# EAGLE design BodyCamBoard (EAGLE 6.6.0)
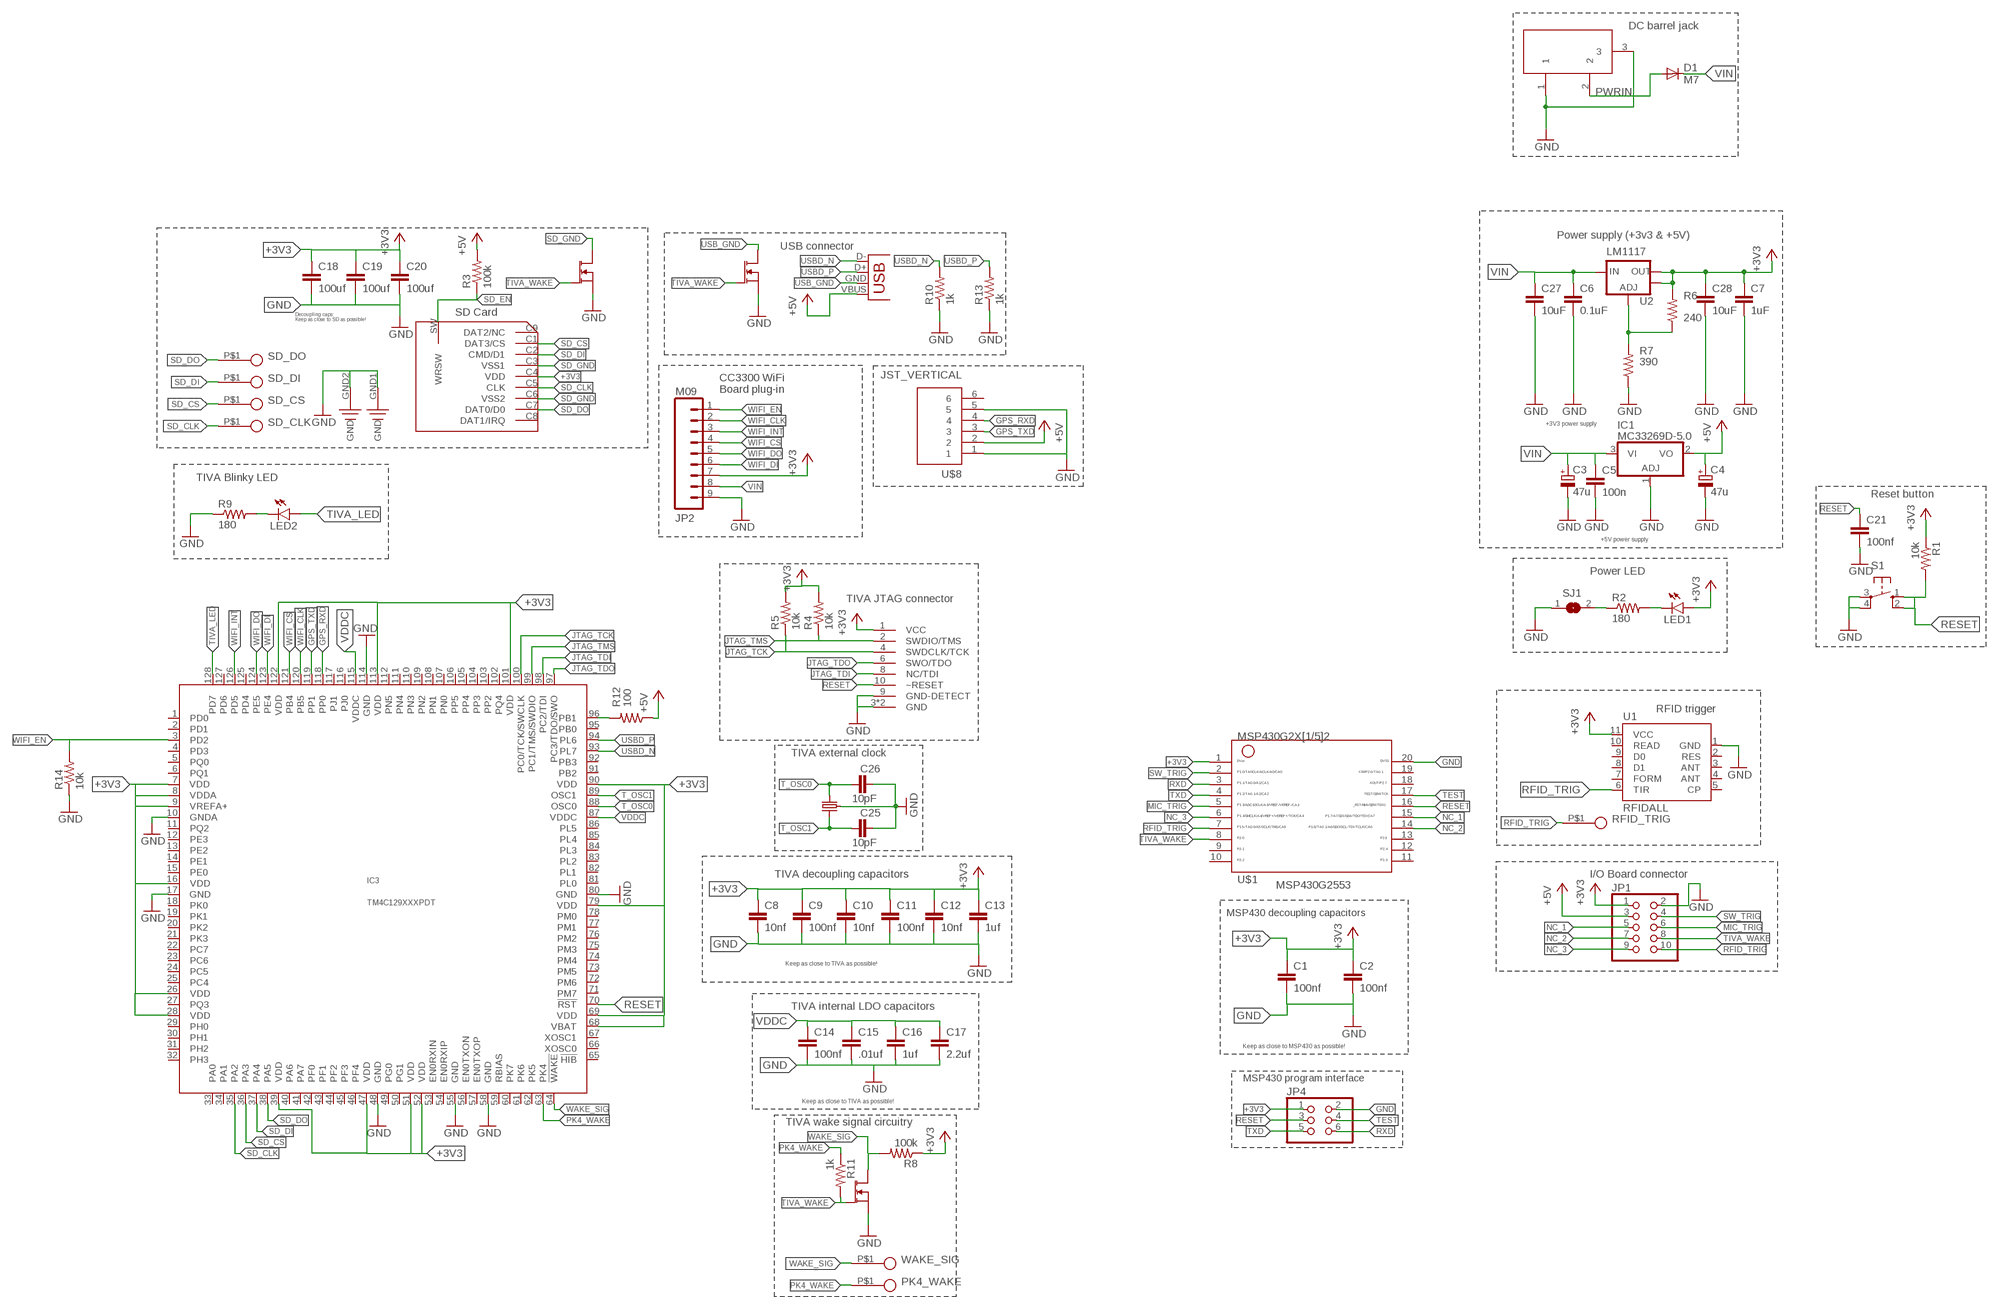
[diagram p0: schematic, sheet 1]

## Parts
C1  100nf  C-EUC0603  [C0603]
C2  100nf  C-EUC0603  [C0603]
C3  47u  CPOL-EUD  [PANASONIC_D]
C4  47u  CPOL-EUD  [PANASONIC_D]
C5  100n  C-EUC0603  [C0603]
C6  0.1uF  CAP0603-CAP  [0603-CAP]
C7  1uF  CAP0603-CAP  [0603-CAP]
C8  10nf  C-EUC0805  [C0805]
C9  100nf  C-EUC0805  [C0805]
C10  10nf  C-EUC0805  [C0805]
C11  100nf  C-EUC0805  [C0805]
C12  10nf  C-EUC0805  [C0805]
C13  1uf  C-EUC0805  [C0805]
C14  100nf  C-EUC0805  [C0805]
C15  .01uf  C-EUC0805  [C0805]
C16  1uf  C-EUC0805  [C0805]
C17  2.2uf  C-EUC0805  [C0805]
C18  100uf  C-EUC1206  [C1206]
C19  100uf  C-EUC1206  [C1206]
C20  100uf  C-EUC1206  [C1206]
C21  100nf  C-EUC0603  [C0603]
C25  10pF  C-EUC0603  [C0603]
C26  10pF  C-EUC0603  [C0603]
C27  10uF  CAP0603-CAP  [0603-CAP]
C28  10uF  CAP0603-CAP  [0603-CAP]
D1  M7  DIODE-SMB  [SMB]
IC1  MC33269D-5.0  [DPACK]
IC3  TM4C129XXXPDT  [PDT_S-PQFP-G128]
JP1  PINHD-2X5  [2X05]
JP2  M09  [1X09]
JP4  PINHD-2X3  [2X03]
LED1  LED0603  [LED-0603@1]
LED2  LED0603  [LED-0603@1]
PK4_WAKE  TEST_POINTSMD_MINI  [TEST_SMD_MINI_5019]
R1  10k  R-US_R0603  [R0603]
R2  180  R-US_R0603  [R0603]
R3  100k  R-US_R0603  [R0603]
R4  10k  R-US_R0603  [R0603]
R5  10k  R-US_R0603  [R0603]
R6  240  RESISTOR0603  [0603-RES]
R7  390  RESISTOR0603  [0603-RES]
R8  100k  R-US_R0603  [R0603]
R9  180  R-US_R0603  [R0603]
R10  1k  R-US_R0402  [R0402]
R11  1k  R-US_R0603  [R0603]
R12  100  RESISTOR0603  [0603-RES]
R13  1k  R-US_R0402  [R0402]
R14  10k  R-US_R0603  [R0603]
RFID_TRIG  TEST_POINTSMD_MINI  [TEST_SMD_MINI_5019]
S1  10-XX  [B3F-10XX]
SD_CLK  TEST_POINTSMD_MINI  [TEST_SMD_MINI_5019]
SD_CS  TEST_POINTSMD_MINI  [TEST_SMD_MINI_5019]
SD_DI  TEST_POINTSMD_MINI  [TEST_SMD_MINI_5019]
SD_DO  TEST_POINTSMD_MINI  [TEST_SMD_MINI_5019]
SJ1  SJ  [SJ]
U1  RFIDALL  [ID_PACKAGE]
U2  LM1117  V_REG_LM1117SOT223  [SOT223]
U$1  G2X[1/5]2---PW20  [PW20]
U$2  CCM05  [CCM05]
U$3  CRYSTAL_403C11E16  [4-SMD-SWITCH]
U$4  IRLML2402TRPBF  [SOT-23]
U$5  IRLML2402TRPBF  [SOT-23]
U$6  IRLML2402TRPBF  [SOT-23]
U$7  2X5_0.05"_CORTEX_DEBUGTH_KEYED_UNSHROUDED  [2X5_0.05"_TH_KEYED_NS]
U$8  JST_VERTICAL  [JST-6-SMD-VERT-1.0MM]
WAKE_SIG  TEST_POINTSMD_MINI  [TEST_SMD_MINI_5019]
X1  USB-A-H  [USB-A-H]
X2  DC21MMX  [DC-21MM]

## Nets
+3V3: C1.1 C2.1 C7.1 C8.1 C9.1 C10.1 C11.1 C12.1 C13.1 C18.1 C19.1 C20.1 C28.1 IC3.7(VDD) IC3.8(VDDA) IC3.9(VREFA+) IC3.16(VDD) IC3.26(VDD) IC3.28(VDD) IC3.39(VDD) IC3.47(VDD) IC3.51(VDD) IC3.52(VDD) IC3.68(VBAT) IC3.69(VDD) IC3.79(VDD) IC3.90(VDD) IC3.101(VDD) IC3.113(VDD) IC3.122(VDD) JP1.1 JP2.7 JP4.1 LED1.A R1.1 R4.2 R5.2 R6.2 R8.1 U1.11(VCC) U2.2(OUT) U2.4(OUT) U$1.1 U$2.C4(SDCARD:VDD) U$7.1(VCC)
+5V: C4.+ IC1.2(VO) JP1.3 R3.2 R12.1 U$8.2 X1.VBUS(GND)
GND: C1.2 C2.2 C3.- C4.- C5.2 C6.2 C7.2 C8.2 C9.2 C10.2 C11.2 C12.2 C13.2 C14.2 C15.2 C16.2 C17.2 C18.2 C19.2 C20.2 C21.2 C25.2 C26.2 C27.2 C28.2 IC1.1(ADJ) IC3.10(GNDA) IC3.17(GND) IC3.48(GND) IC3.55(GND) IC3.58(GND) IC3.80(GND) IC3.114(GND) JP1.2 JP2.9 JP4.2 R7.1 R10.1 R13.1 R14.1 S1.3(P) S1.4(P1) SJ1.1 U1.1(GND) U$1.20 U$2.GND1(GND1:GND) U$2.GND2(GND2:GND) U$3.2(GND) U$3.4(GND) U$4.2(S) U$5.2(S) U$6.2(S) U$7.3(GND) U$7.5(GND) U$7.9(GND-DETECT) U$8.1 U$8.5 X2.1 X2.3
GPS_RXD: IC3.118(PP0) U$8.4
GPS_TXD: IC3.119(PP1) U$8.3
JTAG_TCK: IC3.100(PC0/TCK/SWCLK) R5.1 U$7.4(SWDCLK/TCK)
JTAG_TDI: IC3.98(PC2/TDI) U$7.8(NC/TDI)
JTAG_TDO: IC3.97(PC3/TDO/SWO) U$7.6(SWO/TDO)
JTAG_TMS: IC3.99(PC1/TMS/SWDIO) R4.1 U$7.2(SWDIO/TMS)
MIC_TRIG: JP1.6 U$1.5
N$1: LED1.C R2.2
N$2: R2.1 SJ1.2
N$3: R9.1
N$4: LED2.C R9.2
N$11: R6.1 R7.2 U2.1(ADJ)
N$56: IC3.96(PB1) R12.2
NC_1: JP1.5 U$1.15
NC_2: JP1.7 U$1.14
NC_3: JP1.9 U$1.6
PK4_WAKE: IC3.63(PK4) PK4_WAKE.P$1 R11.1
PWRIN: D1.A X2.2
RESET: C21.1 IC3.70(!RST) JP4.3 R1.2 S1.1(S) S1.2(S1) U$1.16 U$7.10(~RESET)
RFID_TRIG: JP1.10 RFID_TRIG.P$1 U1.6(TIR) U$1.7
RXD: JP4.6 U$1.3
SD_CLK: IC3.35(PA2) SD_CLK.P$1 U$2.C5(SDCARD:CLK)
SD_CS: IC3.36(PA3) SD_CS.P$1 U$2.C1(SDCARD:DAT3/CS)
SD_DI: IC3.37(PA4) SD_DI.P$1 U$2.C2(SDCARD:CMD/D1)
SD_DO: IC3.38(PA5) SD_DO.P$1 U$2.C7(SDCARD:DAT0/D0)
SD_EN: R3.1 U$2.SW(SDCARD:WRSW)
SD_GND: U$2.C3(SDCARD:VSS1) U$2.C6(SDCARD:VSS2) U$5.3(D)
SW_TRIG: JP1.4 U$1.2
T_OSC0: C26.1 IC3.88(OSC0) U$3.3
T_OSC1: C25.1 IC3.89(OSC1) U$3.1
TEST: JP4.4 U$1.17
TIVA_LED: IC3.128(PD7) LED2.A
TIVA_WAKE: JP1.8 R11.2 U$1.8 U$4.1(G) U$5.1(G) U$6.1(G)
TXD: JP4.5 U$1.4
USB_GND: U$4.3(D) X1.GND(VBUS)
USBD_N: IC3.93(PL7) R10.2 X1.D-(D+)
USBD_P: IC3.94(PL6) R13.2 X1.D+(D-)
VDDC: C14.1 C15.1 C16.1 C17.1 IC3.87(VDDC) IC3.115(VDDC)
VIN: C3.+ C5.1 C6.1 C27.1 D1.C IC1.3(VI) JP2.8 U2.3(IN)
WAKE_SIG: IC3.64(!WAKE) R8.2 U$6.3(D) WAKE_SIG.P$1
WIFI_CLK: IC3.120(PB5) JP2.2
WIFI_CS: IC3.121(PB4) JP2.4
WIFI_DI: IC3.123(PE4) JP2.6
WIFI_DO: IC3.124(PE5) JP2.5
WIFI_EN: IC3.3(PD2) JP2.1 R14.2
WIFI_INT: IC3.126(PD5) JP2.3
Unconnected: IC3.1(PD0) IC3.2(PD1) IC3.4(PD3) IC3.5(PQ0) IC3.6(PQ1) IC3.11(PQ2) IC3.12(PE3) IC3.13(PE2) IC3.14(PE1) IC3.15(PE0) IC3.18(PK0) IC3.19(PK1) IC3.20(PK2) IC3.21(PK3) IC3.22(PC7) IC3.23(PC6) IC3.24(PC5) IC3.25(PC4) IC3.27(PQ3) IC3.29(PH0) IC3.30(PH1) IC3.31(PH2) IC3.32(PH3) IC3.33(PA0) IC3.34(PA1) IC3.40(PA6) IC3.41(PA7) IC3.42(PF0) IC3.43(PF1) IC3.44(PF2) IC3.45(PF3) IC3.46(PF4) IC3.49(PG0) IC3.50(PG1) IC3.53(EN0RXIN) IC3.54(EN0RXIP) IC3.56(EN0TXON) IC3.57(EN0TXOP) IC3.59(RBIAS) IC3.60(PK7) IC3.61(PK6) IC3.62(PK5) IC3.65(!HIB) IC3.66(XOSC0) IC3.67(XOSC1) IC3.71(PM7) IC3.72(PM6) IC3.73(PM5) IC3.74(PM4) IC3.75(PM3) IC3.76(PM2) IC3.77(PM1) IC3.78(PM0) IC3.81(PL0) IC3.82(PL1) IC3.83(PL2) IC3.84(PL3) IC3.85(PL4) IC3.86(PL5) IC3.91(PB2) IC3.92(PB3) IC3.95(PB0) IC3.102(PQ4) IC3.103(PP2) IC3.104(PP3) IC3.105(PP4) IC3.106(PP5) IC3.107(PN0) IC3.108(PN1) IC3.109(PN2) IC3.110(PN3) IC3.111(PN4) IC3.112(PN5) IC3.116(PJ0) IC3.117(PJ1) IC3.125(PD4) IC3.127(PD6) U1.2(RES) U1.3(ANT) U1.4(ANT) U1.5(CP) U1.7(FORM) U1.8(D1) U1.9(D0) U1.10(READ) U$1.9 U$1.10 U$1.11 U$1.12 U$1.13 U$1.18 U$1.19 U$2.C8(SDCARD:DAT1/IRQ) U$2.C9(SDCARD:DAT2/NC) U$8.6

## Notes on the sheet
- DC barrel jack
- Power supply (+3v3 & +5V)
- USB connector
- SD Card
- Decoupling caps:
  Keep as close to SD as possible!
- CC3300 WiFi 
  Board plug-in
- +3V3 power supply
- TIVA Blinky LED
- Reset button
- +5V power supply
- Power LED
- TIVA JTAG connector
- RFID trigger
- TIVA external clock
- TIVA decoupling capacitors | I/O Board connector
- MSP430G2553
- MSP430 decoupling capacitors
- Keep as close to TIVA as possible!
- TIVA internal LDO capacitors
- Keep as close to MSP430 as possible!
- MSP430 program interface
- Keep as close to TIVA as possible!
- TIVA wake signal circuitry

## Library data of the parts
C1 C2 C5 C8-C21 = rcl:C-EU: CAPACITOR, European symbol
C3 C4 = rcl:CPOL-EU: POLARIZED CAPACITOR, European symbol
C6 C7 C27 C28 = SparkFun-Capacitors:CAP: Capacitor Standard 0603 ceramic capacitor, and 0.1" leaded capacitor.
C25 C26 = Jon_LIB:C-EU: CAPACITOR, European symbol; DIGIKEY#: 399-1049-1-ND
D1 = diode:DIODE-: DIODE
IC1 = linear:MC33269?*: Adjustable Output Low Dropout Voltage Regulator 800 mA Source: http://www.onsemi.com/pub/Collateral/MC33269-D.PDF
IC3 = ti-tiva:TM4C129XXX
JP1 = pinhead:PINHD-2X5: PIN HEADER
JP2 = SparkFun-Connectors:M09: Header 9 Standard 9-pin 0.1" header. Use with straight break away headers (SKU : PRT-00116), right angle break away headers (PRT-00553), swiss pins (PRT-00743), machine pins (PRT-00117), and female headers (PRT-00115).
JP4 = pinhead:PINHD-2X3: PIN HEADER
LED1 LED2 = SparkFun-LED:LED: LEDs Standard schematic elements and footprints for 5mm, 3mm, 1206, and 0603 sized LEDs. 5mm - Spark Fun Electronics SKU : COM-00529 (and others)
PK4_WAKE RFID_TRIG SD_CLK SD_CS SD_DI SD_DO WAKE_SIG = MAAV_Standard:TEST_POINT
R1-R5 R8 R9 R11 R14 = resistor:R-US_: RESISTOR, American symbol
R6 R7 R12 = SparkFun-Resistors:RESISTOR: Resistor Basic schematic elements and footprints for 0603, 1206, and PTH resistors.
R10 R13 = rcl:R-US_: RESISTOR, American symbol
S1 = switch-omron:10-XX: OMRON SWITCH; MPN: B3F-1000; OC_FARNELL: 176432; OC_NEWARK: 36M3542
SJ1 = jumper:SJ: SMD solder JUMPER
U1 = ID_Innovations:RFID
U2 = SparkFun-PowerIC:V_REG_LM1117: Voltage Regulator LM1117 Standard adjustable voltage regulator but in SMD form. Spark Fun Electronics SKU : COM-00595
U$1 = TI_MSP430_v16:G2X[1/5]2---PW20: MSP430G2X[1/5]2 MSP430G2x52, MSP430G2x12 TSSOP (PW) 20 Pin Package http://focus.ti.com/docs/prod/folders/print/msp430g2452.html
U$2 = sd:CCM05
U$3 = imu:CRYSTAL_403C11E16; DIGIKEY: 403C11E16M00000
U$4-U$6 = MOSFET:IRLML2402TRPBF
U$7 = con-cortex:2X5_0.05"_CORTEX_DEBUG
U$8 = SparkFun-Connectors:JST_VERTICAL; PROD_ID: CONN-08249
X1 = SparkFun:USB: USB Connectors USB-B-PTH is fully proven SKU : PRT-00139 USB-miniB is fully proven SKU : PRT-00587 USB-A-PCB is untested. USB-A-H is throughly reviewed, but untested. Spark Fun Electronics SKU : PRT-00437 USB-B-SMT is throughly reviewed, but untested. Needs silkscreen touching up. USB-A-S has not been used/tested USB-MB-H has not been used/tested
X2 = powersupply:DC21MM

## Board
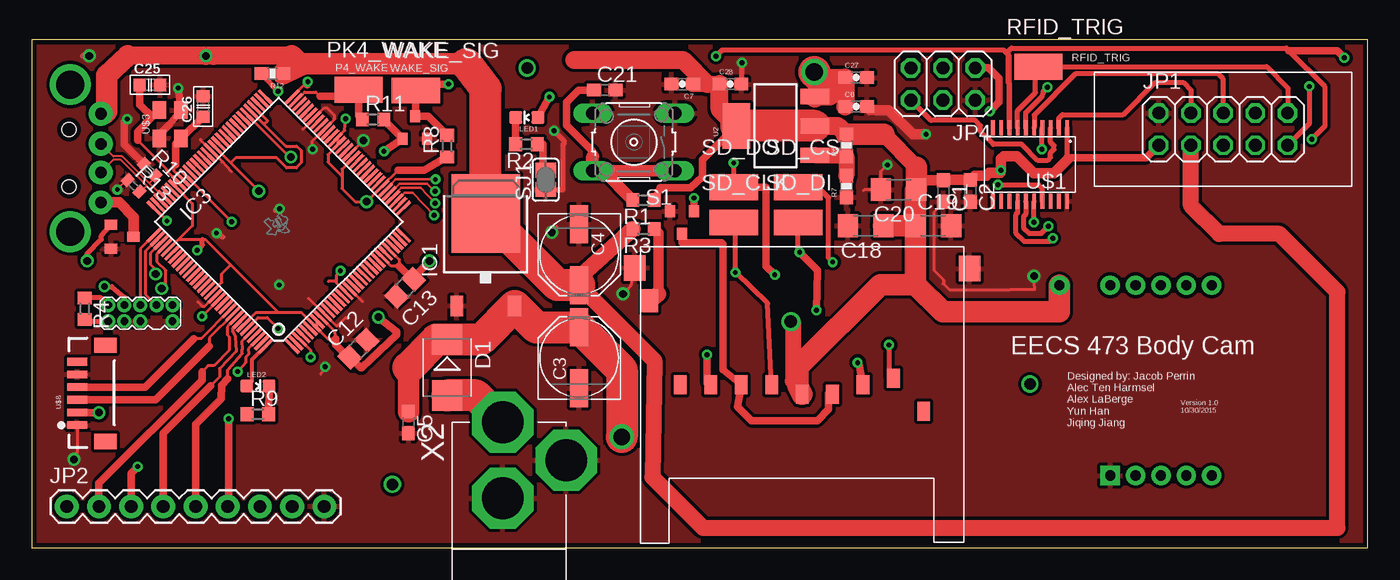
[diagram p1: board, top side]
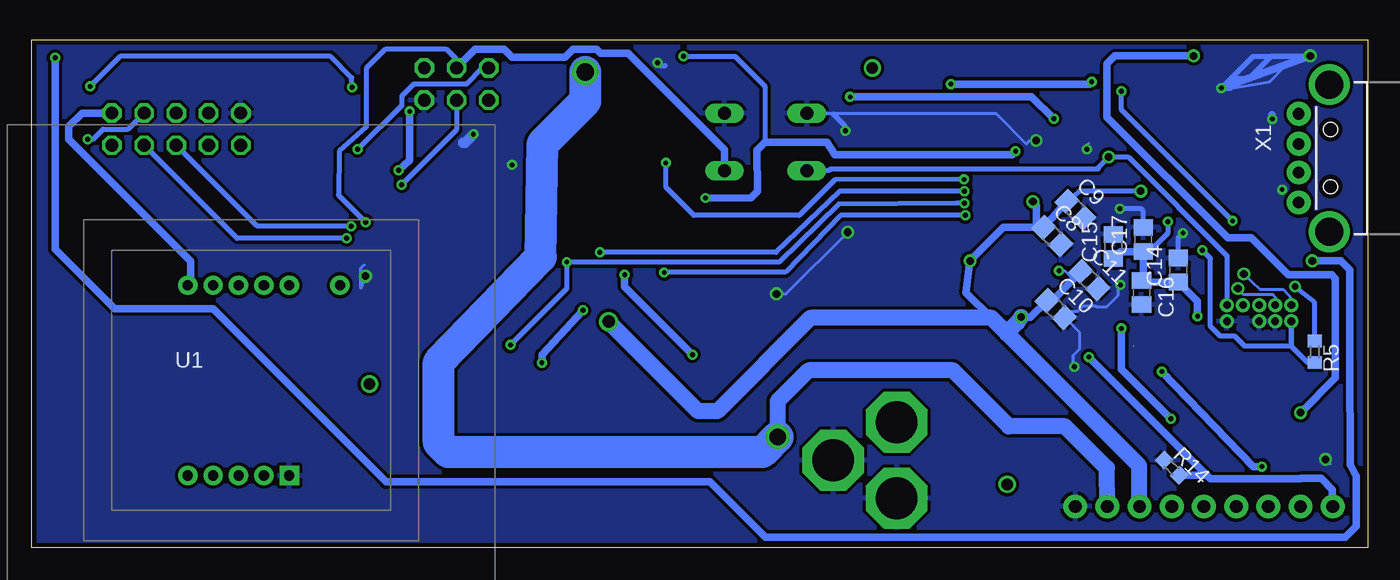
[diagram p2: board, bottom side, seen from below]

Size 105.39 x 40.06 mm. Coordinates in mm from the lower left corner, seen from the top.
Outline: 0,0 105.39,0 105.39,40.06 0,40.06 0,0
Copper layers (1*16): Top 0.035559375mm / dielectric 1.501140625mm / Bottom 0.035559375mm
Design rules "typical_4pcb *": minimum track width 6mil, minimum drill 15mil, track to track 5mil, track to pad 5mil, pad to pad 5mil, via to via 5mil, smd to smd 5mil, copper to edge 15mil, drill to drill 8mil, minimum pad ring 10mil, minimum via ring 8mil, stop-mask expansion 4mil, vias tented up to drill 0mil, thermal gap 10mil

### Footprints (pad centres in the part's own frame; a part is rotated, then mirrored left to right if it is on the bottom)
C0603 = smd 1.1 x 1: 1 -0.85,0; 2 0.85,0
PANASONIC_D = smd 3 x 1.4: + 2.4,0; - -2.4,0
0603-CAP = smd 1.1 x 1: 1 -0.85,0; 2 0.85,0
C0805 = smd 1.3 x 1.5: 1 -0.95,0; 2 0.95,0
C1206 = smd 1.6 x 1.8: 1 -1.4,0; 2 1.4,0
C0603' = smd 0.95 x 1: 1 -0.8,0; 2 0.8,0
SMB = smd 2.4 x 2.4: A 2.2,0; C -2.2,0
DPACK = smd 1 x 1.6: 1 -2.28,-4.8; 3 2.28,-4.8 | smd 5.4 x 6.2: 2 0,2.5
PDT_S-PQFP-G128 = smd 0.25 x 1.6: 1 -6.2,-7.65; 2 -5.8,-7.65; 3 -5.4,-7.65; 4 -5,-7.65; 5 -4.6,-7.65; 6 -4.2,-7.65; 7 -3.8,-7.65; 8 -3.4,-7.65; 9 -3,-7.65; 10 -2.6,-7.65; 11 -2.2,-7.65; 12 -1.8,-7.65; 13 -1.4,-7.65; 14 -1,-7.65; 15 -0.6,-7.65; 16 -0.2,-7.65; 17 0.2,-7.65; 18 0.6,-7.65; 19 1,-7.65; 20 1.4,-7.65; 21 1.8,-7.65; 22 2.2,-7.65; 23 2.6,-7.65; 24 3,-7.65; 25 3.4,-7.65; 26 3.8,-7.65; 27 4.2,-7.65; 28 4.6,-7.65; 29 5,-7.65; 30 5.4,-7.65; 31 5.8,-7.65; 32 6.2,-7.65; 65 6.2,7.65; 66 5.8,7.65; 67 5.4,7.65; 68 5,7.65; 69 4.6,7.65; 70 4.2,7.65; 71 3.8,7.65; 72 3.4,7.65; 73 3,7.65; 74 2.6,7.65; 75 2.2,7.65; 76 1.8,7.65; 77 1.4,7.65; 78 1,7.65; 79 0.6,7.65; 80 0.2,7.65; 81 -0.2,7.65; 82 -0.6,7.65; 83 -1,7.65; 84 -1.4,7.65; 85 -1.8,7.65; 86 -2.2,7.65; 87 -2.6,7.65; 88 -3,7.65; 89 -3.4,7.65; 90 -3.8,7.65; 91 -4.2,7.65; 92 -4.6,7.65; 93 -5,7.65; 94 -5.4,7.65; 95 -5.8,7.65; 96 -6.2,7.65 | smd 1.6 x 0.25: 33 7.65,-6.2; 34 7.65,-5.8; 35 7.65,-5.4; 36 7.65,-5; 37 7.65,-4.6; 38 7.65,-4.2; 39 7.65,-3.8; 40 7.65,-3.4; 41 7.65,-3; 42 7.65,-2.6; 43 7.65,-2.2; 44 7.65,-1.8; 45 7.65,-1.4; 46 7.65,-1; 47 7.65,-0.6; 48 7.65,-0.2; 49 7.65,0.2; 50 7.65,0.6; 51 7.65,1; 52 7.65,1.4; 53 7.65,1.8; 54 7.65,2.2; 55 7.65,2.6; 56 7.65,3; 57 7.65,3.4; 58 7.65,3.8; 59 7.65,4.2; 60 7.65,4.6; 61 7.65,5; 62 7.65,5.4; 63 7.65,5.8; 64 7.65,6.2; 97 -7.65,6.2; 98 -7.65,5.8; 99 -7.65,5.4; 100 -7.65,5; 101 -7.65,4.6; 102 -7.65,4.2; 103 -7.65,3.8; 104 -7.65,3.4; 105 -7.65,3; 106 -7.65,2.6; 107 -7.65,2.2; 108 -7.65,1.8; 109 -7.65,1.4; 110 -7.65,1; 111 -7.65,0.6; 112 -7.65,0.2; 113 -7.65,-0.2; 114 -7.65,-0.6; 115 -7.65,-1; 116 -7.65,-1.4; 117 -7.65,-1.8; 118 -7.65,-2.2; 119 -7.65,-2.6; 120 -7.65,-3; 121 -7.65,-3.4; 122 -7.65,-3.8; 123 -7.65,-4.2; 124 -7.65,-4.6; 125 -7.65,-5; 126 -7.65,-5.4; 127 -7.65,-5.8; 128 -7.65,-6.2
2X05 = drill 1.016 octagon: 1 -5.08,-1.27; 2 -5.08,1.27; 3 -2.54,-1.27; 4 -2.54,1.27; 5 0,-1.27; 6 0,1.27; 7 2.54,-1.27; 8 2.54,1.27; 9 5.08,-1.27; 10 5.08,1.27
1X09 = drill 1.016 pad 1.88: 1 0,0; 2 2.54,0; 3 5.08,0; 4 7.62,0; 5 10.16,0; 6 12.7,0; 7 15.24,0; 8 17.78,0; 9 20.32,0
2X03 = drill 1.016 octagon: 1 -2.54,-1.27; 2 -2.54,1.27; 3 0,-1.27; 4 0,1.27; 5 2.54,-1.27; 6 2.54,1.27
LED-0603@1 = smd 1 x 1: A 0,-0.877; C 0,0.877
TEST_SMD_MINI_5019 = smd 3.81 x 2.032: P$1 0,0
R0603 = smd 1 x 1.1: 1 -0.85,0; 2 0.85,0
0603-RES = smd 1.1 x 1: 1 -0.85,0; 2 0.85,0
R0402 = smd 0.7 x 0.9: 1 -0.65,0; 2 0.65,0
B3F-10XX = drill 1.016 long: 1 -3.251,2.261; 2 3.251,2.261; 3 -3.251,-2.261; 4 3.251,-2.261
SJ = smd 1.168 x 1.6: 1 -0.762,0; 2 0.762,0
ID_PACKAGE = drill 0.8 pad 1.524 square: 1 3,-7.5 | drill 0.8 pad 1.524: 2 1,-7.5; 3 -1,-7.5; 4 -3,-7.5; 5 -5,-7.5; 6 -5,7.5; 7 -3,7.5; 8 -1,7.5; 9 1,7.5; 10 3,7.5; 11 7,7.5
SOT223 = smd 1.219 x 2.235: 1 -2.311,-3.099; 2 0,-3.099; 3 2.311,-3.099 | smd 3.6 x 2.2: 4 0,3.099
PW20 = smd 0.3 x 1.2: 1 -2.925,-2.9; 2 -2.275,-2.9; 3 -1.625,-2.9; 4 -0.975,-2.9; 5 -0.325,-2.9; 6 0.325,-2.9; 7 0.975,-2.9; 8 1.625,-2.9; 9 2.275,-2.9; 10 2.925,-2.9; 11 2.925,2.9; 12 2.275,2.9; 13 1.625,2.9; 14 0.975,2.9; 15 0.325,2.9; 16 -0.325,2.9; 17 -0.975,2.9; 18 -1.625,2.9; 19 -2.275,2.9; 20 -2.925,2.9
CCM05 = smd 1.5 x 1: C1 1.25,-7.2; C2 0.75,-4.8; C3 0,-2.4; C4 0,0; C5 0.75,2.4; C6 0.75,4.8; C7 0.75,7.2; C8 0.75,9.6; C9 -1.35,-9.6 | smd 2 x 1.7: GND1 9.95,13.2; GND2 9.9,-13.2 | smd 1.8 x 1.3: SW 7.35,12
4-SMD-SWITCH = smd 1.372 x 1.067: 1 -1.118,-0.864; 2 1.118,-0.864; 3 1.118,0.864; 4 -1.118,0.864
SOT-23 = smd 0.965 x 0.787: 1 -0.886,0.953; 2 -0.886,-0.953; 3 0.886,0
2X5_0.05"_TH_KEYED_NS = drill 0.6 pad 0.95: 1 -2.54,-0.635; 2 -2.54,0.635; 3 -1.27,-0.635; 4 -1.27,0.635; 5 0,-0.635; 6 0,0.635; 8 1.27,0.635; 9 2.54,-0.635; 10 2.54,0.635
JST-6-SMD-VERT-1.0MM = smd 0.6 x 1.55: 1 -2.54,1.27; 2 -1.54,1.27; 3 -0.54,1.27; 4 0.46,1.27; 5 1.46,1.27; 6 2.46,1.27 | smd 1.2 x 1.8: P$1 -3.84,-0.955; P$2 3.76,-0.955
USB-A-H = drill 0.914 pad 1.88: D+ 2.4,1.127; D- 2.4,-1.127; GND 2.4,3.5; VBUS 2.4,-3.5 | drill 2.2: GND@1 0,5.8; GND@2 0,-5.8 | hole 1.1: -0.1,2.25; -0.1,-2.25
DC-21MM = drill 3.302 pad 4.826 octagon: 1 -5.08,-3.353; 2 -0.076,-6.35; 3 -0.076,-0.356

### Placement (x,y rotation side)
C1  71.91,28.13 270 top
C2  74.04,28.16 270 top
C3  43.18,14.99 90 top
C4  43.18,23.11 270 top
C5  29.72,9.91 270 top
C6  65.02,34.8 0 top
C7  51.31,36.58 180 top
C8  24.9,24.59 315 bottom
C9  23.06,26.66 315 bottom
C10  24.62,18.84 315 bottom
C11  21.95,21.13 315 bottom
C12  25.76,15.7 45 top
C13  29.44,20.5 225 top
C14  14.95,21.91 90 bottom
C15  20.07,23.78 90 bottom
C16  17.84,20.13 270 bottom
C17  17.72,24.32 90 bottom
C18  65.79,25.4 180 top
C19  71.12,25.4 0 top
C20  68.39,28.26 180 top
C21  45.21,36.1 0 top
C25  10pF  [C0603']  9.33,36.51 0 top
C26  10pF  [C0603']  13.53,34.8 90 top
C27  65.02,37.08 0 top
C28  55.12,36.58 0 top
D1  32.77,14.22 270 top
IC1  35.81,23.88 0 top
IC3  19.48,25.73 45 top
JP1  93.98,33.02 0 top
JP2  2.76,3.27 0 top
JP4  71.88,36.58 180 top
LED1  39.05,33.94 90 top
LED2  17.84,12.76 270 top
PK4_WAKE  25.78,36.13 0 top
R1  48.26,27.43 180 top
R2  39.02,31.85 180 top
R3  48.26,25.15 180 top
R4  4.19,18.86 270 top
R5  4.19,15.46 270 bottom
R6  64.26,31.75 90 top
R7  64.26,28.51 90 top
R8  32.77,31.69 90 top
R9  17.84,10.54 0 top
R10  9.3,29.82 315 top
R11  26.92,33.78 0 top
R12  18.99,37.4 180 top
R13  8.03,28.55 315 top
R14  15.47,6.33 315 bottom
RFID_TRIG  79.41,37.94 0 top
S1  47.5,32 180 top
SD_CLK  55.37,25.65 0 top
SD_CS  60.45,28.45 0 top
SD_DI  60.45,25.65 0 top
SD_DO  55.37,28.45 0 top
SJ1  40.54,29.02 90 top
U1  88.07,13.21 0 bottom
U2  58.67,33.27 90 top
U$1  78.74,30.23 180 top
U$2  60.77,12.13 90 top
U$3  10.92,33.4 270 top
U$4  7.14,24.54 0 top
U$5  51.31,25.65 270 top
U$6  30.23,33.15 90 top
U$7  8.57,18.51 0 top
U$8  4.86,12.22 90 top
WAKE_SIG  30.29,36.07 0 top
X1  3.05,30.73 180 bottom
X2  37.08,3.56 180 top

### Tracks (layer width: path | path; a pad name or v marks a point on that pad's centre or on a via)
+3V3  (via drill 0.38, 0.6, 1)
  Top 0.254: 23.87,32.13 IC3.52 24.19,32.41 | IC3.47 24.48,29.88 24.48,29.3 | 24.19,32.41 24.7,32.93 v24.77,33.85 | 28.89,29.78 27.58,28.47 | 27.58,28.47 IC3.39 | IC3.113 14.99,20.95 14.99,21.62 15.64,22.27 15.73,22.27 | IC3.9 23.86,17.11 23.96,16.58 | 23.96,16.58 23.97,16.51 | IC3.28 28.99,22.73 28.99,22.23 28.35,22.23 27.61,22.97 IC3.26 | 22.49,17.36 IC3.7 21.26,18.57 19.43,18.57 | 22.49,17.36 23.34,16.51 23.89,16.51 23.96,16.58 | IC3.122 16.77,17.63 17.72,18.57 19.43,18.57 | IC3.101 10.84,23.57 11.59,24.32 | 11.59,24.32 13.46,24.32 13.68,24.32 15.73,22.27 | 15.73,22.27 19.43,18.57 | 27.58,28.47 v26.42,27.3 25.5,27.3 24.48,28.32 24.48,29.3 | IC3.79 15.7,30.36 | 15.7,30.36 17.91,28.15 v17.91,28.13 | IC3.68 18.57,33.72 18.57,33.66 18.35,33.43 18.29,33.43 IC3.69 20.03,31.69 20.89,31.69 21.24,31.34 21.24,30.35 20.86,29.97 20.1,29.97 19.3,30.77 16.1,30.77 15.7,30.36 | IC3.90 11.39,28.43 12.67,27.15 12.67,25.4 11.59,24.32 | 24.07,20.86 23.92,21.01 23.39,21.01 | IC3.16 24.07,20.86 | 24.07,20.86 24.07,21.56 v24.35,21.84 | IC3.8 22.49,17.36 | 24.19,32.41 IC3.51 23.37,31.02 23.37,30.42 24.48,29.3
  Top 0.406: U$1.1 81.66,30.77 81.66,30.57 | R4.2 4.33,17.88 U$7.1 | v13.05,23.46 13.46,23.88 13.46,24.32
  Top 0.61: v40.83,35.56 40.82,35.55 LED1.A | R8.1 30.95,29.78 28.89,29.78 | R1.1 49.56,28.38 51.98,28.42 52.9,29.27 52.9,30.59 U2.4 | 81.66,30.77 87.92,30.77 JP1.1 | JP4.1 75.47,37.85 76.3,37.02 76.3,35.15 v75.56,34.42 | 23.97,16.51 23.97,16.03 24.57,15.44 C12.1 25.93,14.19 26.04,14.19 28.8,16.8 28.8,17.05 28.77,17.05 v27.34,18.19 | v31.37,22.64 30.12,21.32 C13.1 30.04,21.18 28.99,22.23
  Top 0.813: 81.66,30.57 80.64,29.56 79.06,29.56 77.72,30.9 76.68,30.9 76.45,30.68 v76.45,29.78 76.42,29.59 75.53,29.59 75.3,29.35 74.38,29.35 C2.1 71.94,29.01 C1.1 70.51,28.98 C20.1
  Top 1.27: 67.22,32.6 69.79,30.04 | C28.1 53.28,36.58 C7.1 | v59.88,17.84 60.04,17.84 60.04,13.18 60.45,12.76
  Top 1.422: U2.2 63.59,33.27 R6.2 | U2.4 54.27,34.58 C28.1 | 42.8,38.48 51.37,38.48 53.28,36.58
  Top 1.676: 69.72,20.77 71.88,18.61 81.08,18.61 U1.11 | 69.72,20.77 C19.1 | C19.1 69.72,28.19 C20.1 69.79,30.04 | C19.1 C18.1 | 69.72,20.77 66.93,20.77 60.45,14.29 60.45,12.76 U$2.C4 | R6.2 67.22,32.6
  Top 2.54: U2.2 U2.4
  Bottom 0.254: v24.35,21.84 23.91,21.84 23.23,21.17 | 23.29,21.1
  Bottom 0.406: R5.2 4.74,14.61 6.03,15.91 U$7.1 6.03,15.94 6,15.91 9.72,15.91 10.51,16.7 11.65,16.7 12.41,17.46 12.41,22.83 v13.05,23.46 | v17.91,28.13 22.72,28.13 C9.1
  Bottom 0.61: v24.77,33.85 26.54,35.56 v40.83,35.56 | v75.56,34.42 75.56,30.57 v76.45,29.78 | 29.69,18.13 31.69,20.13 v31.37,22.64 28.74,25.27 26.13,25.27 | v27.34,18.19 26.61,18.19 C10.1 24.89,19.51 23.29,21.1 23.23,21.17 C11.1 | 26.13,25.27 C8.1 C9.1 | v26.42,27.3 26.13,27.02 26.13,25.27
  Bottom 1.27: JP2.7 18.03,6.48 28.48,16.92 | 28.48,16.92 29.69,18.13 43.97,18.13 51.31,10.79 52.83,10.79 v59.88,17.84 | v27.34,18.19 27.62,17.78 28.48,16.92
+5V  (via drill 0.6)
  Top 0.61: U$8.2 3.6,10.67 v5.3,10.67
  Top 1.27: 43.02,21.17 43.18,20.92 C4.+ | R3.2 43.02,21.17 | 43.02,21.17 43.4,20.48 49.12,14.76 48.96,5.59 52.96,1.59 103,1.59 103,20.19 98.42,24.77 93.66,24.77 91.44,26.99 JP1.3
  Top 1.422: 20.51,38.8 14.32,38.8 v13.75,38.8 7.56,38.8
  Top 1.676: 34.29,38.16 21.49,38.16 R12.1 20.85,38.46 20.51,38.8 | 7.56,38.8 5.91,37.27 5.91,34.42 5.72,34.23 X1.VBUS
  Top 2.54: C4.+ 41.48,20.71 IC1.2 35.81,36.2 34.29,38.16
  Bottom 0.61: v5.3,10.67 2.57,13.4 2.57,21.24 2.86,21.53 6.25,21.53 9.18,24.45 11.05,24.45 20.57,33.97 20.57,38.16 19.93,38.8 v13.75,38.8
GND  (via drill 0.38, 0.6)
  Top 0.152: R13.1 7.45,29.01 v6.76,28.26
  Top 0.254: IC3.10 24.01,17.53 24.13,17.53 24.77,18.16 24.99,18.16 | IC3.10 23.62,17.91 | IC3.10 21.88,19.65 21.84,19.65 | IC3.80 13.34,32.16 13.3,32.19 14.99,30.51 | 14.99,30.51 15.02,30.42 | 14.99,30.51 15.75,29.69 | 21.4,33.02 IC3.58 23.08,34.7 23.27,34.7 23.84,34.13 23.84,33.77 IC3.55 23.04,32.94 23.01,32.94 22.1,32.04 v22.16,31.43 | IC3.48 v26.16,32.13 | U$8.1 3.59,7.62 v3.33,6.99 | U$2.GND1 47.25,20.64 v46.64,20.03 | v41.02,24.89 41.02,24.92 41.43,25.34 | 65.63,28.19 65.69,28.26 C20.2 66.99,29.68 v67.5,30.19 | C1.2 71.91,27.21 71.18,26.48 71.18,21.88 71.91,21.14 71.91,20.83 72.39,20.35 77.15,20.35 77.18,20.38 79.12,20.38 v79.06,21.43 | IC3.17 26.07,19.43 | IC3.114 13.62,19.02 13.49,19.02 13.11,19.4 | v23.15,14.29 23.15,14.06 22.8,13.72 | v19.53,20.73 19.56,20.73
  Top 0.406: 56.01,38.23 56.01,36.62 C28.2 56.04,36.65 v56.04,38.26 | v4.54,38.8 4,38.8 | v14.57,24.83 14.76,24.83 15.08,24.51 | v19.56,26.73 19.37,26.73 19.24,26.61 | SJ1.1 41.88,28.26 41.91,28.23 41.91,31.78 42.01,31.88 42.01,32.1 v41.21,32.89
  Top 0.61: U$3.2 10.06,32.57 10.86,33.37 U$3.4 v11.56,36.26 | R10.1 8.84,30.3 7.3,31.84 7.3,33.59 v7.53,33.81
  Top 0.813: C6.2 66.16,34.51 67.6,34.51 69.5,32.61 v70.55,32.61
  Bottom 0.152: v6.76,28.26 6.89,28.42 6.92,28.38
  Bottom 0.254: 10.79,36.26 7.75,36.77 6.54,37.97 | v11.56,36.26 10.99,36.83 10.16,36.83 | v26.16,32.13 26.64,32.13 26.92,31.84 29.3,34.23 42.2,34.23 44.23,34.23 | 3.37,7.02 v3.33,6.99 2.98,6.64 | v46.64,20.03 45.88,20.03 v41.02,24.89 | v79.06,21.43 79.44,20.48 79.44,22.04 79.15,22.32 | v67.5,30.19 67.5,30.39 67.47,30.42 | C10.2 23.88,18.17 | 23.88,18.17 23.24,17.53 23.24,17.49 22.77,17.02 22.77,15.65 23.27,15.14 23.27,14.41 v23.15,14.29 | 23.88,18.17 23.88,18.41 23.62,18.67 22.86,18.67 22.45,19.08 21.5,19.08 21.43,19.02 20.57,19.02 19.68,19.91 19.68,20.57 v19.53,20.73 | v22.16,31.43 22.04,31.88
  Bottom 0.406: v56.04,38.26 55.82,38.04 55.4,38.04 | 10.79,36.26 v11.56,36.26 10.76,37.05 | 10.76,37.05 9.05,38.77 4.76,38.77 | 10.76,37.05 9.34,37.05 7.59,38.8 v4.54,38.8 | C14.2 14.95,24.45 v14.57,24.83 | C17.2 17.72,26.57 17.88,26.73 v19.56,26.73 | v41.21,32.89 41.21,33.24 42.2,34.23
  Bottom 0.61: v11.56,36.26 v4.54,38.8 | v7.53,33.81 7.53,34.13 7.56,34.16
  Bottom 0.813: v70.55,32.61 71.22,31.94 71.37,31.94
  pour Bottom (isolate 0.254): -4.06,104.65 -4.06,-4.83 164.34,-4.83 164.34,104.65
  pour Top (isolate 0.254): -7.87,-8.13 10.16,-8.38 169.16,-8.38 169.16,109.98 -7.62,109.98 -7.62,4.83
GPS_RXD
  Top 0.254: IC3.118 13.38,16.51 12.79,16.51
  Top 0.61: 12.79,16.51 8.97,12.68 U$8.4
GPS_TXD
  Top 0.254: IC3.119 14,16.57 14,15.91
  Top 0.61: 14,15.91 9.78,11.68 U$8.3
JTAG_TCK  (via drill 0.5, 0.6)
  Top 0.254: IC3.100 9.87,23.19 9.87,22.57 10.57,21.88 10.57,20.77 v10.26,20.45
  Top 0.406: v5.75,20.61 6.32,20.61 7.3,19.78 U$7.4
  Bottom 0.254: U$7.4 7.3,19.78 7.49,19.97 9.81,19.97 10.26,20.41 v10.26,20.45
  Bottom 0.406: R5.1 4.19,19.37 v5.75,20.61
JTAG_TDI
  Top 0.254: IC3.98 8.95,23.4 8.95,20 9.81,19.14 U$7.8
JTAG_TDO
  Top 0.254: IC3.97 8.57,23.59 U$7.6
JTAG_TMS  (via drill 0.6)
  Top 0.254: IC3.99 9.37,23.25 9.37,22.35 9.78,21.94 v9.78,21.59
  Top 0.406: U$7.2 5.47,19.71 R4.1
  Bottom 0.254: v9.78,21.59 8.51,20.38 6.67,20.38 6.03,19.68 U$7.2
MIC_TRIG
  Top 0.406: JP1.6 93.98,36.99 93.6,37.37 82.33,37.37 79.09,34.13 79.09,33.15 U$1.5
N$1
  Top 0.61: LED1.C R2.2
N$2
  Top 0.61: R2.1 40.35,31.82 40.35,29.97 SJ1.2
N$4
  Top 0.61: LED2.C R9.2
N$5  (via drill 0.9)
  other vias: 28.45,5.02
N$6  (via drill 0.9)
  other vias: 78.74,12.92
N$7  (via drill 0.9)
  other vias: 39.08,37.85
N$11
  Top 1.27: R7.2 R6.1 64.2,30.96 U2.1
N$56  (via drill 0.38)
  Top 0.254: IC3.96 v10.67,25.78
  Top 0.406: v19.43,36.01 19.15,36.28 R12.2
  Bottom 0.406: v10.67,25.78 19.43,34.54 v19.43,36.01
NC_1  (via drill 0.38)
  Top 0.406: U$1.15 78.42,26.31 78.23,26.13 78.23,25.24 78.68,24.8 79.63,24.8 v80.2,25.37
  Bottom 0.406: v80.2,25.37 87.6,25.37 JP1.5
NC_2  (via drill 0.38)
  Top 0.406: U$1.14 77.77,26.43 77.6,26.26 77.6,24.86 78.3,24.16 80.3,24.16 v80.55,24.42
  Bottom 0.406: v80.55,24.42 89.19,24.42 JP1.7
NC_3  (via drill 0.38)
  Top 0.406: v100.78,36.39 100.78,33.47 JP1.9 | U$1.6 78.42,34.31 79.69,35.59 79.79,35.91 79.79,36.01 v80.11,36.32
  Bottom 0.406: v100.78,36.39 98.39,38.77 81.82,38.77 80.14,37.08 v80.11,36.32
PK4_WAKE
  Top 0.203: IC3.63 20.82,35.24 21.53,35.94
  Top 0.254: 21.53,35.94 22.42,35.94 22.73,35.62
  Top 0.61: R11.1 25.78,34.08 PK4_WAKE.P$1 25.27,35.62 22.73,35.62
PWRIN
  Top 2.54: X2.2 35.04,12.02 D1.A
RESET  (via drill 0.38, 0.6)
  Top 0.254: IC3.70 20.32,30.83
  Top 0.406: v79.06,25.69 79.06,27.32 U$1.16 | 20.32,30.83 v20.45,30.83
  Top 0.61: 44.25,30.88 44.25,31.29 42.2,33.34 42.2,35.15 43.15,36.1 C21.1
  Top 0.889: S1.1 S1.2 45.1,29.74 R1.2
  Top 1.016: S1.2 44.25,30.88
  Bottom 0.254: 21.27,29.88 20.35,30.8 20.35,30.83
  Bottom 0.406: JP4.3 71.88,38.51 72.68,39.31 77.5,39.31 78.99,37.81 78.99,33.18 81.12,31.27 81.19,27.81 v79.06,25.69 | S1.2 42.52,29.74 42.39,29.88 21.27,29.88 21.27,30 v20.45,30.83 | 20.35,30.83 18.89,30.83 11.11,23.05 U$7.10
  Bottom 0.61: S1.1 50.75,31.38 58.36,38.99 60.52,38.99 60.83,39.31 62.67,39.31 63.31,38.67 67.5,38.67 68.14,39.31 70.42,39.31 JP4.3
RFID_TRIG
  Top 0.406: U$1.7 77.77,34.49 79.18,35.91 79.18,37.72 RFID_TRIG.P$1 97.41,37.94 99.09,36.26 99.09,34.32 JP1.10
  Bottom 0.61: JP1.10 101.41,34.29 102.46,33.24 102.46,32.23 92.84,22.61 92.84,20.95 U1.6
RXD
  Top 0.406: JP4.6 70.93,33.72 74.42,33.72 74.83,33.31 74.83,32.83 75.85,31.81 78.11,31.81 79.38,30.54 80.11,30.54 80.36,30.8 80.36,31.15 80.64,31.43 80.64,31.72 80.36,32 U$1.3
SD_CLK  (via drill 0.38)
  Top 0.203: IC3.35 29.4,28 30.04,28 v31.75,26.23
  Top 0.406: SD_CLK.P$1 55.5,25.53 v55.5,21.72 58.05,19.29 U$2.C5
  Bottom 0.406: v31.75,26.23 41.59,26.23 45.94,21.75 55.47,21.75 v55.5,21.72 55.44,21.84
SD_CS  (via drill 0.38)
  Top 0.203: IC3.36 29.15,28.38 30.67,28.38 v31.81,27.18
  Top 0.406: v63.18,22.54 62.87,22.86 62.87,27.62 62.23,28.26 60.64,28.26 SD_CS.P$1 | v67.63,16 67.63,13.47 U$2.C1
  Bottom 0.406: v31.81,27.18 32.45,27.18 41.72,27.11 46.42,22.54 v63.18,22.54 63.18,20.45 v67.63,16
SD_DI  (via drill 0.38)
  Top 0.203: IC3.37 29.02,28.73 31.18,28.73 v31.81,28.13
  Top 0.406: v60.58,23.3 60.45,23.43 SD_DI.P$1
  Top 0.61: v60.58,23.3 61.98,21.91 v61.91,18.73 | v65.15,14.61 65.25,14.5 U$2.C2
  Bottom 0.406: v31.81,28.13 41.62,28.13 46.67,23.3 v60.58,23.3
  Bottom 0.61: v61.91,18.73 65.15,15.24 v65.15,14.61
SD_DO  (via drill 0.38)
  Top 0.203: IC3.38 28.7,29.08 31.81,29.08 v31.84,29.05
  Top 0.406: v55.37,30.35 SD_DO.P$1
  Top 0.61: U$2.C7 53.28,12.97 v53.28,15.24 | v58.61,21.53 57.91,22.23 57.91,28.45 SD_DO.P$1
  Bottom 0.406: v31.84,29.05 42.04,29.02 44.83,26.23 53.15,26.23 SD_DO.P$1 v55.37,30.35
  Bottom 0.61: v53.28,15.24 58.61,20.57 v58.61,21.53
SD_EN
  Top 0.813: 49.43,20.04 49.43,24.83 R3.1
  Top 1.27: 49.43,20.04 U$2.SW
SD_GND
  Top 0.61: U$2.C3 62.87,12.18 62.87,10.92 61.98,10.03 56.77,10.03 55.65,11.15 U$2.C6 54.55,14.05 54.55,23.94 54.42,24.07 51.31,24.07 U$5.3
SW_TRIG
  Top 0.406: U$1.2 81.02,33.87 81.31,34.16 86.11,34.16 88.65,36.7 90.84,36.7 91.44,36.1 JP1.4
T_OSC0
  Top 0.254: IC3.88 11.24,29.72 11.24,30.1 11.37,30.23
  Top 0.61: 11.37,30.23 11.37,31.86 U$3.3 11.81,32.28 C26.1
T_OSC1
  Top 0.254: IC3.89 11.65,28.73 10.64,29.75 10.64,29.84 8.35,32.13
  Top 0.61: 8.35,32.13 8.35,32.81 9.52,33.98 | 9.52,33.98 U$3.1 | C25.1 8.53,34.96 9.52,33.98
TEST  (via drill 0.38)
  Top 0.406: v76.2,28.64 79.41,28.64 79.69,28.38 79.69,27.35 U$1.17
  Bottom 0.406: JP4.4 71.88,32.99 v76.2,28.64
TIVA_LED  (1 unrouted)
  Top 0.305: 18.46,15.92 17.37,14.83 17.37,13.16 LED2.A
TIVA_WAKE  (via drill 0.38, 0.6)
  Top 0.406: v100.97,32.23 101.98,33.24 101.98,36.39 99.17,39.2 98.97,39.4 77.28,39.4 77.03,39.15 77.03,36.7 77.15,36.58 77.15,33.16 U$1.8 77.11,38.8 76.68,39.24 54.45,39.24 v53.98,38.77 | v4.38,22.64 4.38,23.21 5.49,24.32 5.49,24.6 U$4.1
  Top 0.61: v27.78,31.27 U$6.1 27.77,33.76 R11.2 | v52.23,27.59 52.26,27.43 U$5.1 | v103.54,38.64 102.98,39.2 99.17,39.2
  Bottom 0.406: v100.97,32.23 100.55,32.23 99.76,33.02 97.79,33.02 JP1.8 | v53.98,38.77 49.91,38.77 47.56,36.42 47.56,32
  Bottom 0.61: v27.78,31.27 28.04,31.02 42.04,31.02 42.67,32 47.56,32 48.2,31.37 48.13,28.12 48.64,27.61 v52.23,27.59 | v103.54,38.64 103.54,23.56 98.84,18.86 91.09,18.86 77.44,5.21 51.88,5.21 47.53,0.86 1.78,0.86 0.92,1.71 0.92,5.65 1.4,6.54 1.43,14.83 1.43,21.94 2.13,22.64 v4.38,22.64
TXD  (via drill 0.38)
  Top 0.406: v79.69,31.43 79.69,33.1 U$1.4
  Bottom 0.406: JP4.5 69.85,37.85 71.12,36.58 75.25,36.58 76.2,35.62 76.2,34.86 v79.69,31.43
USB_GND
  Top 0.813: U$4.3 8.06,26.07 6.89,27.24 X1.GND
USBD_N
  Top 0.152: IC3.93 10.44,27.63 9.28,28.74 | 9.28,28.74 7.14,30.87 6.43,30.87 X1.D- | R10.2 9.76,29.23 9.28,28.74
USBD_P
  Top 0.152: IC3.94 10.26,27.36 9.06,28.56 | 9.06,28.56 7.02,30.59 6.43,30.59 X1.D+ | R13.2 8.6,28.09 9.06,28.56
VDDC  (via drill 0.38)
  Top 0.254: IC3.115 v13.43,18.26 | IC3.87 12.27,29.26 v15.78,25.72
  Bottom 0.406: v15.78,25.72 15.78,24.8 17.14,23.43 17.66,23.43 C17.1
  Bottom 0.61: v13.43,18.26 13.43,19.43 C14.1 17.72,20.96 C16.1 17.72,21.21 C17.1 19.53,23.37 C15.1
VIN  (via drill 1.3, 1.4)
  Top 1.422: 61.77,37.48 62.17,37.08 C27.1 C6.1
  Top 1.676: 29.72,14.22 C5.1 | 61.77,37.48 61.77,36.91 62.93,35.75 61.94,35.75 U2.3
  Top 2.54: 29.72,14.22 31.92,16.42 D1.C 35.44,16.42 IC1.3 39.78,17.39 C3.+ 46.55,14.02 v46.55,8.76 | v61.72,37.53 61.77,37.48
  Bottom 1.27: JP2.8 20.57,6.29 23.88,9.59 28.31,9.59 32.73,14 44.1,14 46.55,11.56 v46.55,8.76
  Bottom 2.54: v46.55,8.76 47.75,7.56 72.52,7.56 73.28,8.32 73.28,14.64 65.25,22.92 65.09,31.88 61.72,35.24 v61.72,37.53
WAKE_SIG  (via drill 0.38)
  Top 0.254: IC3.64 21.5,36.51 21.72,36.51
  Top 0.61: R8.2 31.27,34.03 U$6.3 30.29,34.1 WAKE_SIG.P$1 30.8,36.58 v32.89,36.58 | 21.72,36.51 v21.78,36.77
  Bottom 0.61: v21.78,36.77 21.91,36.58 v32.89,36.58
WIFI_CLK
  Top 0.254: IC3.120 15.43,17.43 15.43,16.8 15.59,16.64 15.59,15.59 14.38,14.38 13.91,14.38 13.43,13.91
  Top 0.61: 13.43,13.91 13.43,13.21 5.3,5.08 JP2.2
WIFI_CS
  Top 0.254: IC3.121 16.45,17.91 15.84,17.3 15.84,17.08 16.07,16.64 16.13,15.49 14.83,14.13 14.83,13.49 14.13,12.79
  Top 0.61: 14.13,12.79 10.38,9.05 JP2.4
WIFI_DI  (via drill 0.38)
  Top 0.254: IC3.123 17.04,17.36 17.84,18.16 18.57,18.16 v19.43,17.3 | 15.53,3.33 JP2.6
  Top 0.61: v15.53,10.19 15.53,3.33
  Bottom 0.61: v19.43,17.3 19.43,14.1 v15.53,10.19
WIFI_DO
  Top 0.254: IC3.124 17.33,17.04 16.57,16.29 16.61,15.65 16.61,15.34 15.46,14.03 15.46,13.34
  Top 0.61: 15.46,13.34 14.99,12.83 14.95,11.78 12.92,9.75 JP2.5
WIFI_EN  (via drill 0.38)
  Top 0.254: IC3.3 22,15.57 v22,15.05
  Bottom 0.61: v22,15.05 12.68,5.73 | JP2.1 2.79,2.92 2.79,4.6 3.68,5.49 5.3,5.49 5.33,5.46 12.41,5.46 12.61,5.65 12.68,5.73 | R14.2 12.68,5.73
WIFI_INT  (via drill 0.38)
  Top 0.254: IC3.126 17.08,15.69 17.11,15.27 16.89,15.05 16.86,14.61 v16.26,13.91
  Top 0.61: v8.35,6.41 7.84,5.91 JP2.3
  Bottom 0.61: v16.26,13.91 9.02,6.41 v8.35,6.41

### Text on the board
tPlace: P4_WAKE | WAKE_SIG | RFID_TRIG | EECS 473 Body Cam | Version 1.0 / 10/30/2015 | Designed by: Jacob Perrin / Alec Ten Harmsel / Alex LaBerge / Yun Han / Jiqing Jiang